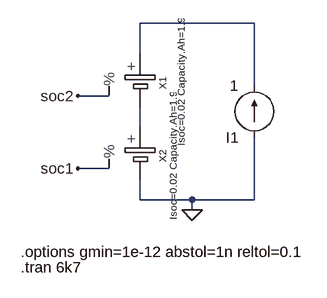
[diagram p0: schematic Li-Ion-2s1p-carga-desgaste.asc]
Li-Ion-2s1p-carga-desgaste.asc, the LTspice schematic file:
Version 4.1
SHEET 1 880 680
WIRE 272 -64 96 -64
WIRE 96 -16 96 -64
WIRE 272 32 272 -64
WIRE 48 48 0 48
WIRE 96 96 96 64
WIRE 48 160 0 160
WIRE 96 208 96 176
WIRE 176 208 96 208
WIRE 272 208 272 112
WIRE 272 208 176 208
WIRE 176 224 176 208
FLAG 176 224 0
FLAG 0 48 soc2
FLAG 0 160 soc1
SYMBOL current 272 112 R180
WINDOW 123 0 0 Left 0
WINDOW 39 0 0 Left 0
SYMATTR InstName I1
SYMATTR Value 1
SYMBOL Circuitos\ Lineales\\LAB-FINAL-CL\\Li-Ion -32 32 R0
WINDOW 39 191 -3 VCenter 1
SYMATTR SpiceLine Isoc=0.02 Capacity.Ah=1.9
SYMATTR InstName X1
SYMBOL Circuitos\ Lineales\\LAB-FINAL-CL\\Li-Ion -32 144 R0
WINDOW 39 179 -1 VCenter 1
SYMATTR SpiceLine Isoc=0.02 Capacity.Ah=1.9
SYMATTR InstName X2
TEXT -88 288 Left 2 !.options gmin=1e-12 abstol=1n reltol=0.1
TEXT -88 312 Left 2 !.tran 6k7

The netlist it stands for:
* Li-Ion-2s1p-carga-desgaste.asc
I1 0 N001 1
X§X1 N001 N002 soc2 Li-Ion Isoc=0.02 Capacity.Ah=1.9  ; pins cell+ cell- V.soc
X§X2 N002 0 soc1 Li-Ion Isoc=0.02 Capacity.Ah=1.9  ; pins cell+ cell- V.soc
.options gmin=1e-12 abstol=1n reltol=0.1
.tran 6k7
.backanno
.end